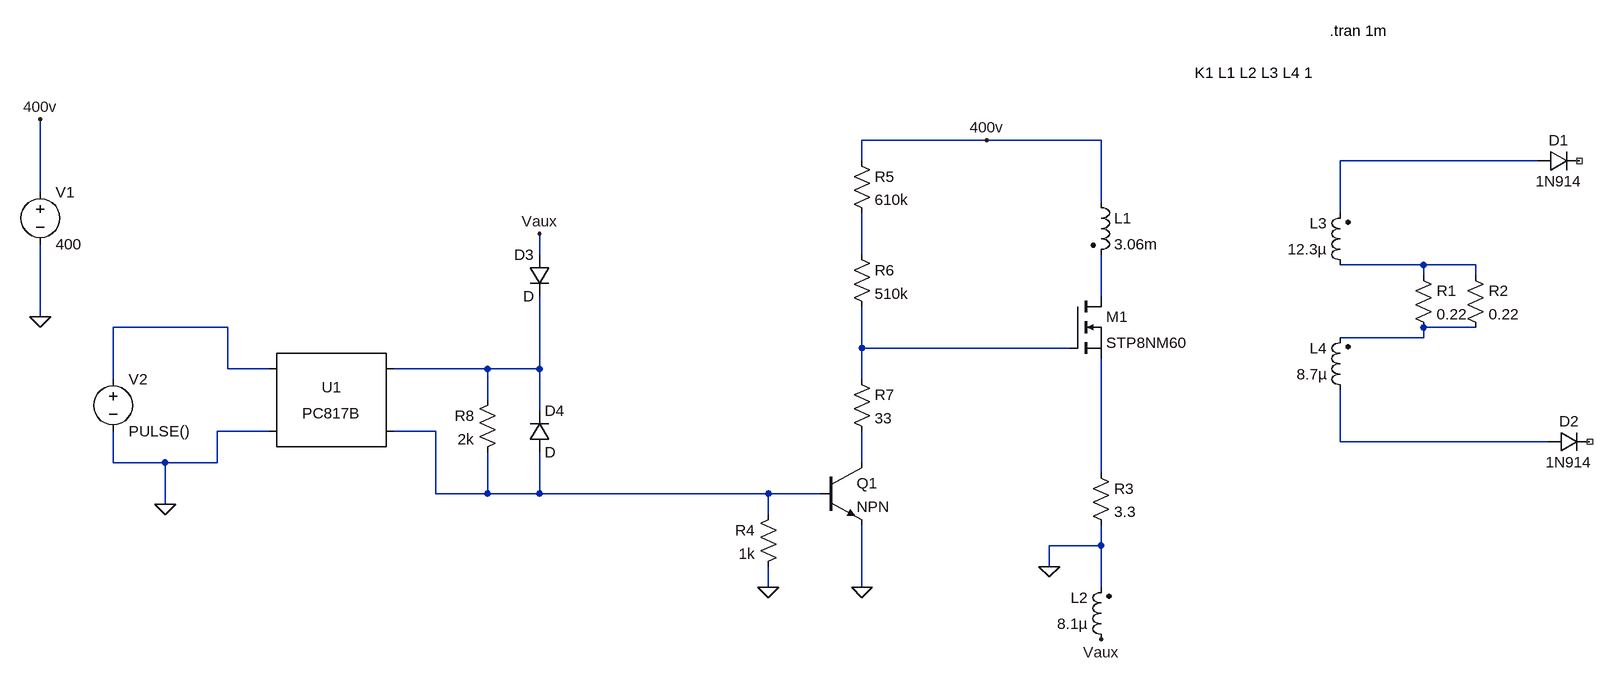
[diagram p0: schematic Simulation.asc]
Simulation.asc, the LTspice schematic file:
Version 4.1
SHEET 1 880 776
WIRE -144 -96 -336 -96
WIRE 32 -96 -144 -96
WIRE -336 -64 -336 -96
WIRE 704 -64 400 -64
WIRE -1600 -16 -1600 -128
WIRE 32 0 32 -96
WIRE 400 16 400 -64
WIRE -832 80 -832 48
WIRE -336 80 -336 16
WIRE 528 96 400 96
WIRE 608 96 528 96
WIRE 528 112 528 96
WIRE 608 112 608 96
WIRE 32 144 32 80
WIRE -1600 176 -1600 64
WIRE -1312 192 -1488 192
WIRE 608 192 528 192
WIRE 528 208 528 192
WIRE 528 208 400 208
WIRE -336 224 -336 160
WIRE -16 224 -336 224
WIRE -1312 256 -1312 192
WIRE -1248 256 -1312 256
WIRE -912 256 -1056 256
WIRE -832 256 -832 144
WIRE -832 256 -912 256
WIRE -1488 272 -1488 192
WIRE -336 272 -336 224
WIRE -912 304 -912 256
WIRE -832 320 -832 256
WIRE -1248 352 -1328 352
WIRE -992 352 -1056 352
WIRE 400 368 400 288
WIRE 720 368 400 368
WIRE -1488 400 -1488 352
WIRE -1408 400 -1488 400
WIRE -1328 400 -1328 352
WIRE -1328 400 -1408 400
WIRE -336 400 -336 352
WIRE 32 416 32 240
WIRE -992 448 -992 352
WIRE -912 448 -912 384
WIRE -912 448 -992 448
WIRE -832 448 -832 384
WIRE -832 448 -912 448
WIRE -480 448 -832 448
WIRE -400 448 -480 448
WIRE -1408 464 -1408 400
WIRE -480 480 -480 448
WIRE 32 528 32 496
WIRE 32 528 -48 528
WIRE -48 560 -48 528
WIRE -480 592 -480 560
WIRE -336 592 -336 496
WIRE 32 592 32 528
FLAG -48 560 0
FLAG -1600 176 0
FLAG -1600 -128 400v
FLAG -144 -96 400v
FLAG 32 672 Vaux
FLAG -832 48 Vaux
FLAG -336 592 0
FLAG -480 592 0
FLAG -1408 464 0
SYMBOL ind2 16 -16 R0
SYMATTR InstName L1
SYMATTR Value 3.06m
SYMATTR Type ind
SYMATTR SpiceLine Rser=3
SYMBOL ind2 48 688 R180
WINDOW 0 36 80 Left 2
WINDOW 3 36 40 Left 2
SYMATTR InstName L2
SYMATTR Value 8.1µ
SYMATTR Type ind
SYMATTR SpiceLine Rser=0.17
SYMBOL ind2 416 112 R180
WINDOW 0 36 80 Left 2
WINDOW 3 36 40 Left 2
SYMATTR InstName L3
SYMATTR Value 12.3µ
SYMATTR Type ind
SYMBOL ind2 416 304 R180
WINDOW 0 36 80 Left 2
WINDOW 3 36 40 Left 2
SYMATTR InstName L4
SYMATTR Value 8.7µ
SYMATTR Type ind
SYMBOL res 512 96 R0
SYMATTR InstName R1
SYMATTR Value 0.22
SYMBOL res 592 96 R0
SYMATTR InstName R2
SYMATTR Value 0.22
SYMBOL diode 704 -48 R270
WINDOW 0 32 32 VTop 2
WINDOW 3 0 32 VBottom 2
SYMATTR InstName D1
SYMATTR Value 1N914
SYMBOL diode 720 384 R270
WINDOW 0 32 32 VTop 2
WINDOW 3 0 32 VBottom 2
SYMATTR InstName D2
SYMATTR Value 1N914
SYMBOL res 16 400 R0
SYMATTR InstName R3
SYMATTR Value 3.3
SYMBOL voltage -1600 -32 R0
WINDOW 123 0 0 Left 0
WINDOW 39 0 0 Left 0
SYMATTR InstName V1
SYMATTR Value 400
SYMBOL nmos -16 144 R0
SYMATTR InstName M1
SYMATTR Value STP8NM60
SYMBOL npn -400 400 R0
SYMATTR InstName Q1
SYMBOL res -352 -80 R0
SYMATTR InstName R5
SYMATTR Value 610k
SYMBOL res -352 64 R0
SYMATTR InstName R6
SYMATTR Value 510k
SYMBOL res -464 464 M0
SYMATTR InstName R4
SYMATTR Value 1k
SYMBOL res -352 256 R0
SYMATTR InstName R7
SYMATTR Value 33
SYMBOL diode -816 80 M0
SYMATTR InstName D3
SYMBOL res -896 288 M0
SYMATTR InstName R8
SYMATTR Value 2k
SYMBOL diode -848 384 M180
WINDOW 0 24 64 Left 2
WINDOW 3 24 0 Left 2
SYMATTR InstName D4
SYMBOL Optos\\PC817B -1152 304 R0
SYMATTR InstName U1
SYMBOL voltage -1488 256 R0
WINDOW 123 0 0 Left 0
WINDOW 39 0 0 Left 0
SYMATTR InstName V2
SYMATTR Value PULSE()
TEXT 176 -200 Left 2 !K1 L1 L2 L3 L4 1
TEXT 384 -264 Left 2 !.tran 1m

The netlist it stands for:
* Simulation.asc
L1 400v N004 3.06m Rser=3
L2 Vaux 0 8.1µ Rser=0.17
L3 N003 N001 12.3µ
L4 N010 N006 8.7µ
R1 N003 N006 0.22
R2 N003 N006 0.22
D1 N001 NC_01 1N914
D2 N010 NC_02 1N914
R3 N012 0 3.3
V1 400v 0 400
M1 N004 N007 N012 N012 STP8NM60
Q1 N011 N009 0 0 NPN
R5 400v N002 610k
R6 N002 N007 510k
R4 N009 0 1k
R7 N007 N011 33
D3 Vaux N008 D
R8 N008 N009 2k
D4 N009 N008 D
X§U1 N005 0 N008 N009 PC817 Igain=1.5m
V2 N005 0 PULSE()
.model D D
.lib standard.dio
.model NPN NPN
.model PNP PNP
.lib standard.bjt
.model NMOS NMOS
.model PMOS PMOS
.lib standard.mos
K1 L1 L2 L3 L4 1
.tran 1m
.lib PC817.sub
.backanno
.end